# EAGLE schematic Shield_behuizing (EAGLE 7.1.0)
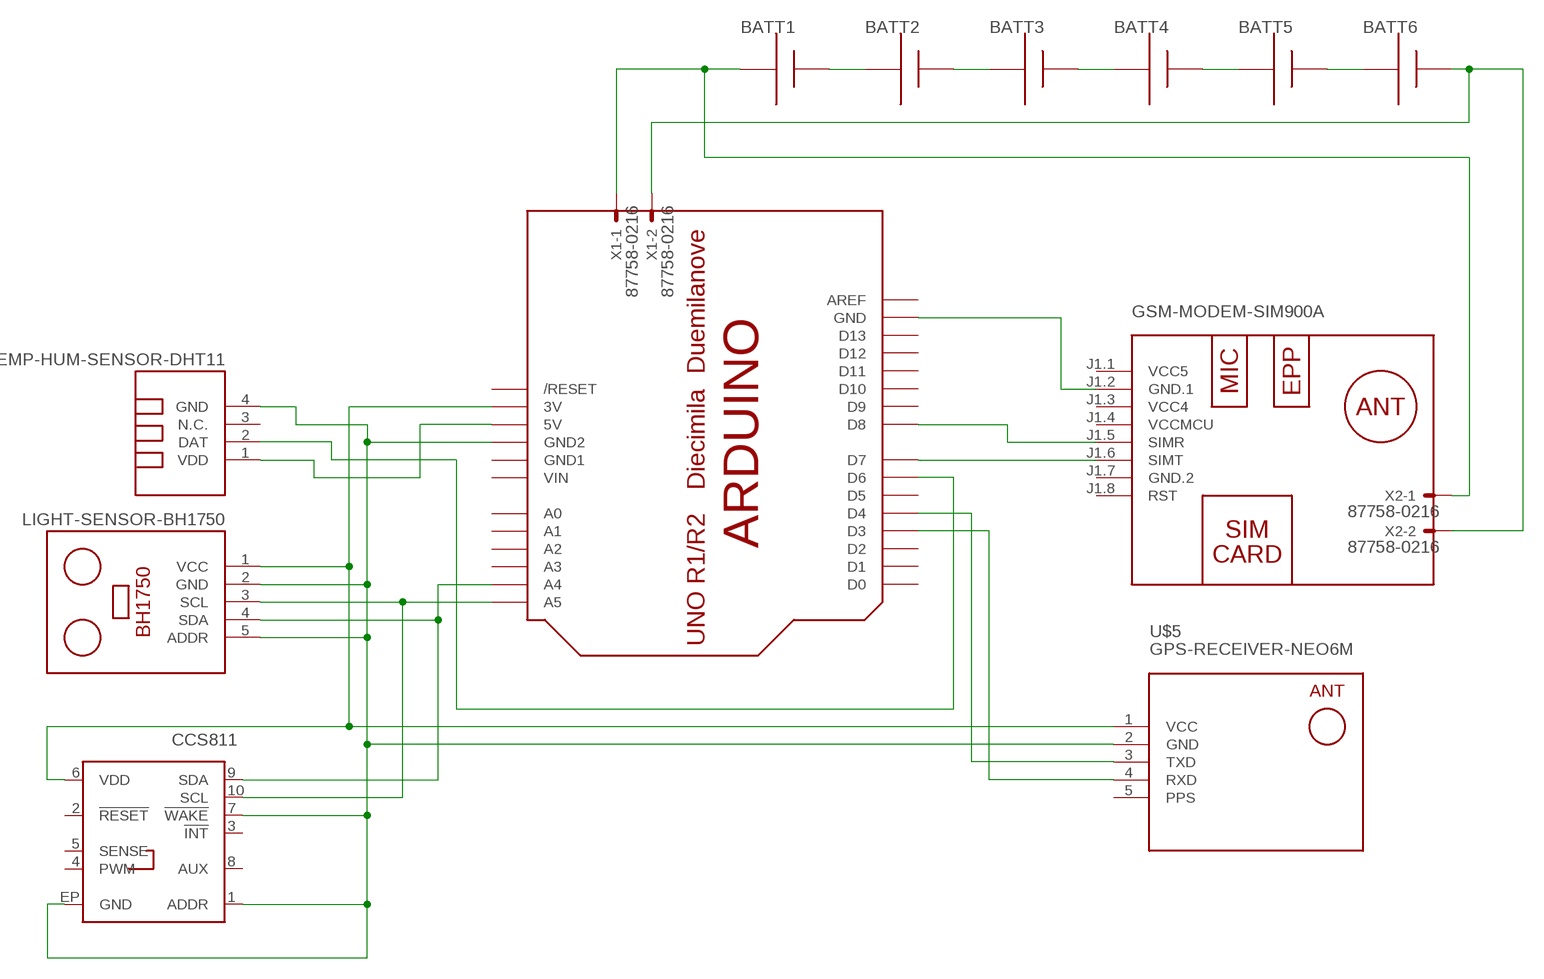
[diagram p0: schematic, sheet 1]

## Parts
BATT1  AAA  [12BH412]
BATT2  AAA  [12BH412]
BATT3  AAA  [12BH412]
BATT4  AAA  [12BH412]
BATT5  AAA  [12BH412]
BATT6  AAA  [12BH412]
U1  CCS811  [LGA10]
U$1  GSM-MODEM-SIM900A  [GSM-MODEM-SIM900A]
U$2  ARDUINO-BPLACE  [ARDUINO-BPLACE]
U$3  TEMP-HUM-SENSOR-DHT11  [TEMP-HUM-SENSOR-DHT11]
U$4  LIGHT-SENSOR-BH1750  [LIGHT-SENSOR-BH1750]
U$5  GPS-RECEIVER-NEO6M  [GPS-RECEIVER-NEO6M]
X1  87758-0216  [87758-0216]
X2  87758-0216  [87758-0216]

## Nets
N$1: U$1.J1.2(GND.1) U$2.GND
N$2: U$1.J1.5(SIMR) U$2.D8
N$3: U$1.J1.6(SIMT) U$2.D7
N$4: BATT1.+ BATT2.-
N$5: U1.1(ADDR) U1.7(!WAKE!) U1.EP(GND) U$2.GND2 U$3.4(GND) U$4.2(GND) U$4.5(ADDR) U$5.2(GND)
N$6: U$2.D6 U$3.2(DAT)
N$7: U1.9(SDA) U$2.A4 U$4.4(SDA)
N$8: U1.10(SCL) U$2.A5 U$4.3(SCL)
N$9: U$2.5V U$3.1(VDD)
N$10: BATT2.+ BATT3.-
N$11: BATT3.+ BATT4.-
N$12: BATT4.+ BATT5.-
N$13: BATT5.+ BATT6.-
N$14: U1.6(VDD) U$2.3V U$4.1(VCC) U$5.1(VCC)
N$15: U$2.D4 U$5.3(TXD)
N$16: BATT1.- X1.1 X2.1
N$17: BATT6.+ X1.2 X2.2
N$18: U$2.D3 U$5.4(RXD)
Unconnected: U1.2(!RESET!) U1.3(!INT!) U1.4(PWM) U1.5(SENSE) U1.8(AUX) U$1.J1.8(RST) U$2.A0 U$2.A1 U$2.A2 U$2.A3 U$2.AREF U$2.D0 U$2.D1 U$2.D2 U$2.D5 U$2.D9 U$2.D10 U$2.D11 U$2.D12 U$2.D13 U$2.RESET(/RESET) U$3.3(N.C.)

## Power pins joined to a net without a drawn wire
GND1: U$2.GND1
GND.2: U$1.J1.7(GND.2)
PPS: U$5.5(PPS)
VCC4: U$1.J1.3(VCC4)
VCC5: U$1.J1.1(VCC5)
VCCMCU: U$1.J1.4(VCCMCU)
VIN: U$2.VIN

## Library data of the parts
BATT1-BATT6 = adafruit:AAA: AAA PC pin holder Mouser part #12BH412 - but pretty much any 1x AAA battery holder should be the same http://www.ladyada.net/library/pcb/eaglelibrary.html
U1 = CCS811_Breakout_Temp:CCS811: AMS CCS811 – I2C Digital Gas Sensor Ultra-Low Power Digital Gas Sensor for Monitoring Indoor Air Quality AMS Product Page <http://ams.com/eng/Products/Environmental-Sensors/Gas-Sensors/CCS811> SparkFun Products:; PROD_ID: IC-13607
U$1 = diy-modules:GSM-MODEM-SIM900A: GSM Mini Module based on SIM900A Schematic available here: http://www.electrodragon.com/w/SIM900_(SIM900A)_Mini_DEV_Board
U$2 = adafruit:ARDUINO: Arduino Diecimila/Duemilanove Make a shield with ease, this package has all the named pins as well as the two mounting drill holes and an outline of the USB and DC power connector. The outline is on the DIMENSION layer, so if your board house uses it they will cut the outline to match. http://www.ladyada.net/library/pcb/eaglelibrary.html
U$3 = diy-modules:TEMP-HUM-SENSOR-DHT11: DHT11 - digital humidity & temperature sensor DHT11 datasheet available here: https://akizukidenshi.com/download/ds/aosong/DHT11.pdf Click here to find device on ebay.com <http://www.ebay.com/sch/dht11+digital+sensor>
U$4 = diy-modules:LIGHT-SENSOR-BH1750: Digital Light Sensor based on BH1750 BH1750 datasheet is available here: http://www.mouser.com/ds/2/348/bh1750fvi-e-186247.pdf Arduino Library for BH1750 is available here: https://github.com/claws/BH1750 Video Tutorial is available here: https://www.youtube.com/watch?v=UsLcHSbxf_8 Click here to find device on ebay.com <http://www.ebay.com/sch/bh1750fvi+module> Note: There are many variants. Search for the proper version.
U$5 = diy-modules:GPS-RECEIVER-NEO6M: GPS Receiver Module based on NEO-6 device Short tutorial how to use NEO-6 module with Arduino: http://www.xarg.org/2016/06/neo6mv2-gps-module-with-arduino/ NEO-6 datasheet is available here: https://www.u-blox.com/sites/default/files/products/documents/NEO-6_DataSheet_%28GPS.G6-HW-09005%29.pdf Click here to find device on ebay.com <http://www.ebay.com/sch/gyneo6mv2>
X1 X2 = con-molex:87758-0216: 2 Pin - 2mm Dual Row Single Wafer, Vertical T/H HDR Source: http://www.molex.com/pdm_docs/sd/877580616_sd.pdf; MF: MOLEX; MPN: 87758-0216; OC_FARNELL: unknown; OC_NEWARK: 94M1513